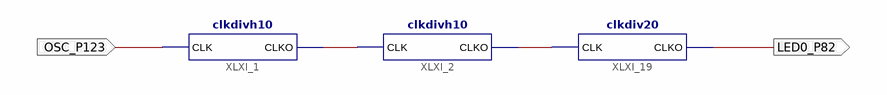
[diagram p0: schematic sheet 1]
// Xilinx ISE schematic integration.sch (spartan6) as structural Verilog: 3 symbols, 2 ports
module integration (
  input  OSC_P123,
  output LED0_P82
);

  wire rastarst7a, XLXN_2;

  clkdivh10 XLXI_1 (.CLK(OSC_P123), .CLKO(XLXN_2));
  clkdivh10 XLXI_2 (.CLK(XLXN_2), .CLKO(rastarst7a));
  clkdiv20 XLXI_19 (.CLK(rastarst7a), .CLKO(LED0_P82));
endmodule
